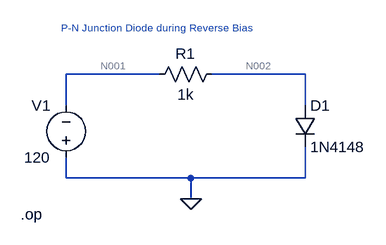
[diagram p0: schematic EEE_2_2.asc]
EEE_2_2.asc, the LTspice schematic file:
Version 4
SHEET 1 880 680
WIRE 160 112 16 112
WIRE 384 112 240 112
WIRE 16 160 16 112
WIRE 384 160 384 112
WIRE 16 272 16 240
WIRE 208 272 16 272
WIRE 384 272 384 224
WIRE 384 272 208 272
WIRE 208 304 208 272
FLAG 208 304 0
SYMBOL voltage 16 256 R180
WINDOW 0 24 96 Left 2
WINDOW 3 24 16 Left 2
SYMATTR InstName V1
SYMATTR Value 120
SYMBOL res 256 96 R90
WINDOW 0 0 56 VBottom 2
WINDOW 3 32 56 VTop 2
SYMATTR InstName R1
SYMATTR Value 1k
SYMBOL diode 368 160 R0
SYMATTR InstName D1
SYMATTR Value 1N4148
TEXT 8 40 Left 1 ;P-N Junction Diode during Reverse Bias
TEXT -54 328 Left 2 !.op

The netlist it stands for:
* EEE_2_2.asc
V1 0 N001 120
R1 N002 N001 1k
D1 N002 0 1N4148
.model D D
.lib standard.dio
* P-N Junction Diode during Reverse Bias
.op
.backanno
.end

* Results of the author's LTspice run, read from the files saved beside the schematic
* Operating Point:
*   V(n001) = -120 V
*   V(n002) = -120 V
*   I(D1) = -2.64 nA
*   I(R1) = 2.64 nA
*   I(V1) = -2.64 nA